# EAGLE design IOBoard (EAGLE 9.6.2)
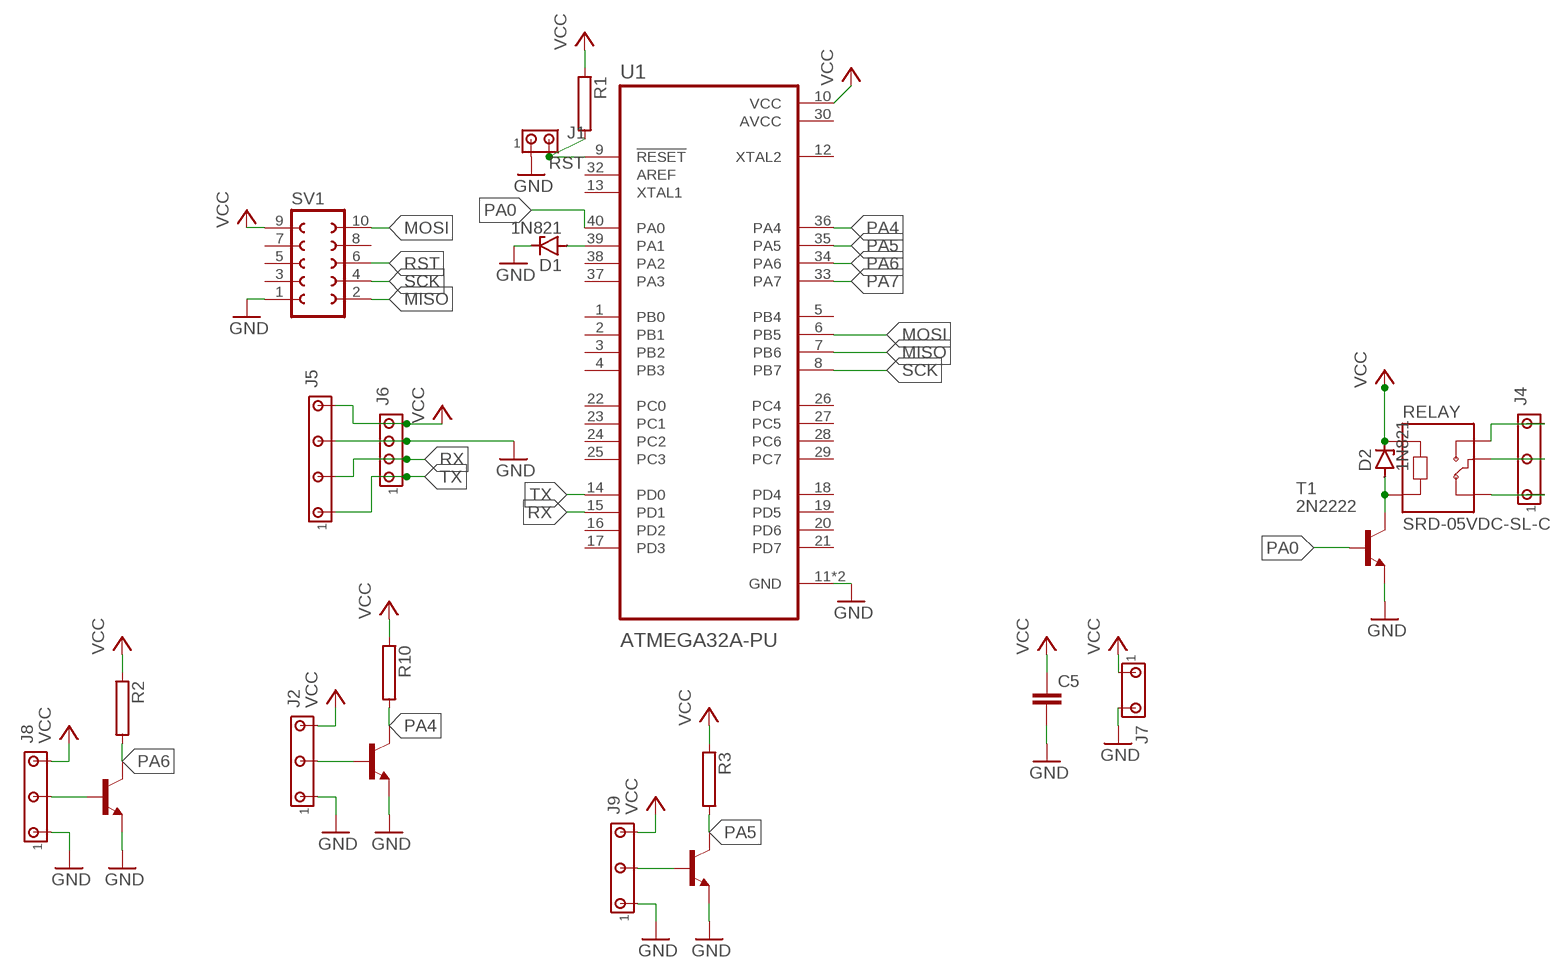
[diagram p0: schematic, sheet 1]

## Parts
C5  C-EU025-024X044  [C025-024X044]
D1  1N821  [DO35Z10]
D2  1N821  [DO35Z10]
J1  MTA02-100  [10X02MTA]
J2  MTA05-156_MYVSPACE1  [10X05MTA_MYV]
J4  MTA05-156_MYVSPACE1  [10X05MTA_MYV]
J5  MTA07-100_MYV  [10X07MTA_MYV]
J6  MTA04-100  [10X04MTA]
J7  MTA03-100_MYV  [10X03MTA_MYV]
J8  MTA05-156_MYVSPACE1  [10X05MTA_MYV]
J9  MTA05-156_MYVSPACE1  [10X05MTA_MYV]
R1  RHPS58  [HPS58]
R2  RHPS58  [HPS58]
R3  RHPS58  [HPS58]
R10  RHPS58  [HPS58]
RELAY  SRD-05VDC-SL-C  [RELAY_SRD-05VDC-SL-C]
SV1  FE05-2_MYV  [FE05-2]
T1  2N2222  [TO18]
T2  2N2222  [TO18]
T5  2N2222  [TO18]
T6  2N2222  [TO18]
U1  ATMEGA32A-PU  [DIP1540W47P254L5320H635Q40B]

## Nets
GND: C5.2 D1.C J1.1 J2.1 J5.5 J6.3 J7.3 J8.1 J9.1 SV1.1 T1.1(E) T2.1(E) T5.1(E) T6.1(E) U1.11(GND) U1.31(GND)
MISO: SV1.2 U1.7(PB6)
MOSI: SV1.10 U1.6(PB5)
N$1: J4.5 RELAY.NO
N$2: J4.3 RELAY.COM
N$3: J4.1 RELAY.NC
N$4: D2.A RELAY.A2 T1.3(C)
N$5: J8.3 T5.2(B)
N$6: J2.3 T2.2(B)
N$7: J9.3 T6.2(B)
PA0: T1.2(B) U1.40(PA0)
PA1: D1.A U1.39(PA1)
PA4: R10.2 T2.3(C) U1.36(PA4)
PA5: R3.2 T6.3(C) U1.35(PA5)
PA6: R2.2 T5.3(C) U1.34(PA6)
PA7: U1.33(PA7)
RST: J1.2 R1.2 SV1.6 U1.9(!RESET)
RX: J5.3 J6.2 U1.15(PD1)
SCK: SV1.4 U1.8(PB7)
TX: J5.1 J6.1 U1.14(PD0)
VCC: C5.1 D2.C J2.5 J5.7 J6.4 J7.1 J8.5 J9.5 R1.1 R2.1 R3.1 R10.1 RELAY.A1 SV1.9 U1.10(VCC)
Unconnected: SV1.3 SV1.5 SV1.7 SV1.8 U1.1(PB0) U1.2(PB1) U1.3(PB2) U1.4(PB3) U1.5(PB4) U1.12(XTAL2) U1.13(XTAL1) U1.16(PD2) U1.17(PD3) U1.18(PD4) U1.19(PD5) U1.20(PD6) U1.21(PD7) U1.22(PC0) U1.23(PC1) U1.24(PC2) U1.25(PC3) U1.26(PC4) U1.27(PC5) U1.28(PC6) U1.29(PC7) U1.32(AREF) U1.37(PA3) U1.38(PA2)

## Power pins joined to a net without a drawn wire
AVCC: U1.30(AVCC)

## Library data of the parts
C5 = rcl:C-EU: CAPACITOR, European symbol; SPICEPREFIX: C
D1 D2 = diode:1N821: Reference DIODE temperature compensated, 6,2 V
J1 = con-amp:MTA02-100: AMP connector
J2 J4 J8 J9 = con-amp_edit:MTA05-156_MYV: AMP connector
J5 = con-amp_edit:MTA07-100_MYV: AMP connector
J6 = con-amp:MTA04-100: AMP connector
J7 = con-amp_edit:MTA03-100_MYV: AMP connector
R1-R3 R10 = resistor-power:R: Power Resitor; OC_FARNELL: unknown; OC_NEWARK: unknown
RELAY = SRD-05VDC-SL-C:SRD-05VDC-SL-C: 5V Trigger Relay Module For Arduino And Raspberry Pi 5V Trigger Relay Module For Arduino And Raspberry Pi; AVAILABILITY: Unavailable; DESCRIPTION: 5V Trigger Relay Module For Arduino And Raspberry Pi 5V Trigger Relay Module For Arduino And Raspberry Pi; MF: Songle Relay; MP: SRD-05VDC-SL-C; PACKAGE: None; PRICE: None
SV1 = con-lsta:FE05-2_MYV: FEMALE HEADER; OC_FARNELL: unknown; OC_NEWARK: unknown
T1 T2 T5 T6 = transistor:2N2222: NPN TRANSISTOR
U1 = ATMEGA32A-PU:ATMEGA32A-PU; AVAILABILITY: Unavailable; DESCRIPTION: IC MCU 8BIT 32KB FLASH 40DIP; MF: Microchip Technology; MP: ATMEGA32A-PU; PACKAGE: None; PRICE: None

## Board
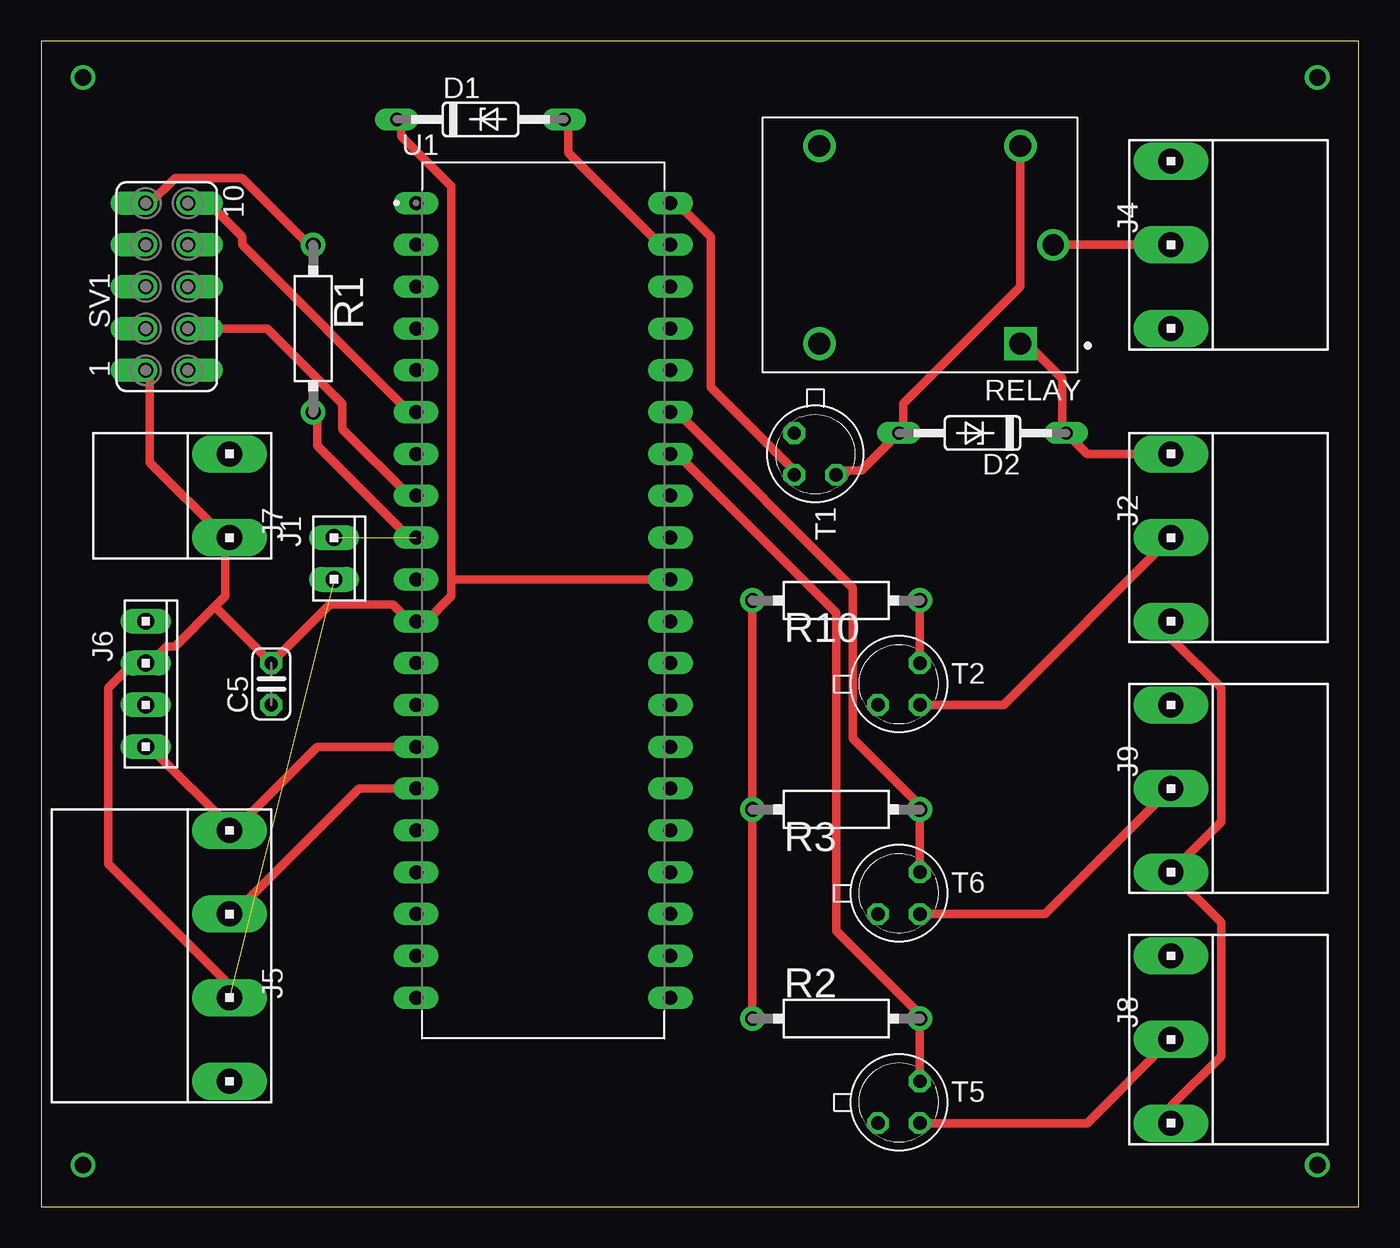
[diagram p1: board, top side]
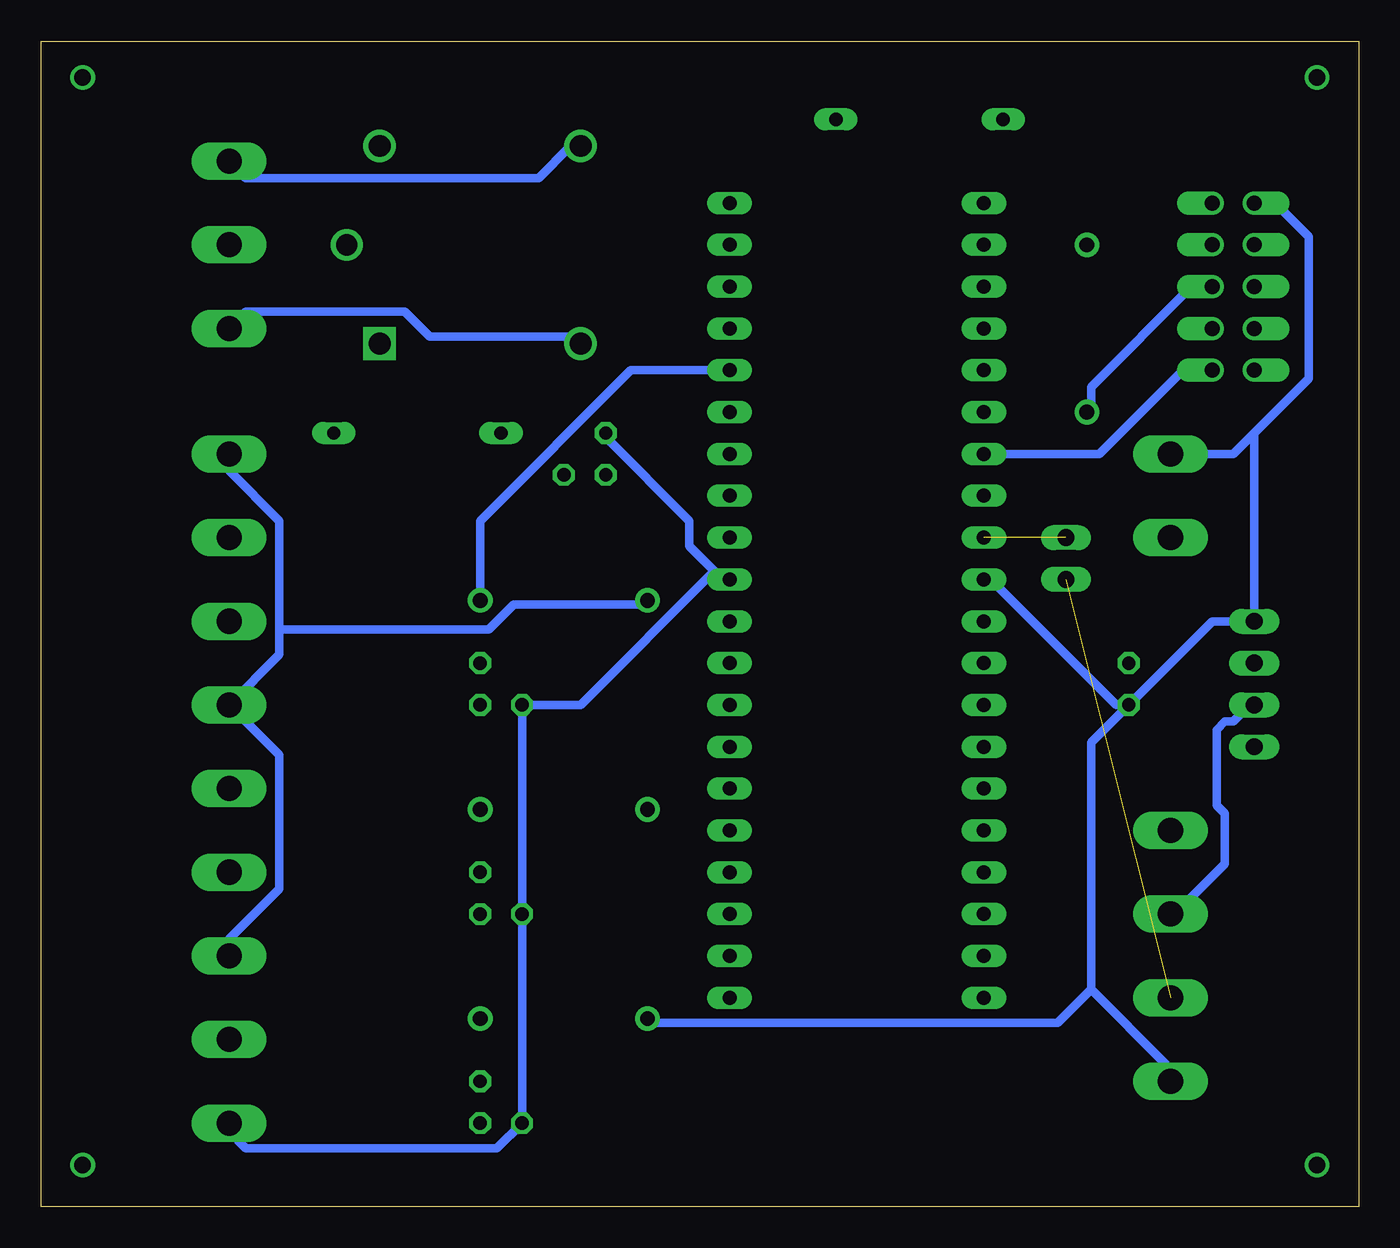
[diagram p2: board, bottom side, seen from below]

Size 79.99 x 70.79 mm. Coordinates in mm from the lower left corner, seen from the top.
Outline: 0,0 79.99,0 79.99,70.79 0,70.79 0,0
Copper layers (1*16): Top 0.035mm / dielectric 1.5mm / Bottom 0.035mm
Design rules "default *": minimum track width 20mil, minimum drill 0.35mm, track to track 20mil, track to pad 20mil, pad to pad 20mil, via to via 20mil, smd to smd 20mil, copper to edge 40mil, drill to drill 6mil, minimum pad ring 10mil, minimum via ring 8mil, stop-mask expansion 4mil, vias tented up to drill 0mil, thermal gap 10mil

### Footprints (pad centres in the part's own frame; a part is rotated, then mirrored left to right if it is on the bottom)
C025-024X044 = drill 0.813 octagon: 1 -1.27,0; 2 1.27,0
DO35Z10 = drill 0.813 long: A 5.08,0; C -5.08,0
10X02MTA = drill 1.016 long: 1 1.27,0; 2 -1.27,0
10X05MTA_MYV = drill 1.524 long: 1 5.08,0; 3 0,0; 5 -5.08,0
10X07MTA_MYV = drill 1.524 long: 1 7.62,0; 3 2.54,0; 5 -2.54,0; 7 -7.62,0
10X04MTA = drill 1.016 long: 1 3.81,0; 2 1.27,0; 3 -1.27,0; 4 -3.81,0
10X03MTA_MYV = drill 1.524 long: 1 2.54,0; 3 -2.54,0
HPS58 = drill 0.9 pad 1.5: 1 -5.08,0; 2 5.08,0
RELAY_SRD-05VDC-SL-C = drill 1.32 square: A1 -6.1,6 | drill 1.32: A2 -6.1,-6; NC 6.1,6; NO 6.1,-6 | drill 1.29: COM -8.1,0
FE05-2 = drill 0.914 offset: 1 -5.08,1.27; 2 -5.08,-1.27; 3 -2.54,1.27; 4 -2.54,-1.27; 5 0,1.27; 6 0,-1.27; 7 2.54,1.27; 8 2.54,-1.27; 9 5.08,1.27; 10 5.08,-1.27
TO18 = drill 0.813 octagon: 1 -1.27,-1.27; 2 1.27,-1.27; 3 1.27,1.27
DIP1540W47P254L5320H635Q40B = drill 0.85 pad 1.28 long: 1 -7.718,24.13; 2 -7.718,21.59; 3 -7.718,19.05; 4 -7.718,16.51; 5 -7.718,13.97; 6 -7.718,11.43; 7 -7.718,8.89; 8 -7.718,6.35; 9 -7.718,3.81; 10 -7.718,1.27; 11 -7.718,-1.27; 12 -7.718,-3.81; 13 -7.718,-6.35; 14 -7.718,-8.89; 15 -7.718,-11.43; 16 -7.718,-13.97; 17 -7.718,-16.51; 18 -7.718,-19.05; 19 -7.718,-21.59; 20 -7.718,-24.13; 21 7.718,-24.13; 22 7.718,-21.59; 23 7.718,-19.05; 24 7.718,-16.51; 25 7.718,-13.97; 26 7.718,-11.43; 27 7.718,-8.89; 28 7.718,-6.35; 29 7.718,-3.81; 30 7.718,-1.27; 31 7.718,1.27; 32 7.718,3.81; 33 7.718,6.35; 34 7.718,8.89; 35 7.718,11.43; 36 7.718,13.97; 37 7.718,16.51; 38 7.718,19.05; 39 7.718,21.59; 40 7.718,24.13

### Placement (x,y rotation side)
C5  13.97,31.75 90 top
D1  26.67,66.04 0 top
D2  57.15,46.99 180 top
J1  17.78,39.37 270 top
J2  68.58,40.64 270 top
J4  68.58,58.42 270 top
J5  11.43,15.24 90 top
J6  6.35,31.75 270 top
J7  11.43,43.18 90 top
J8  68.58,10.16 270 top
J9  68.58,25.4 270 top
R1  16.51,53.34 270 top
R2  48.26,11.43 0 top
R3  48.26,24.13 0 top
R10  48.26,36.83 0 top
RELAY  53.34,58.42 180 top
SV1  7.62,55.88 90 top
T1  46.99,45.72 270 top
T2  52.07,31.75 0 top
T5  52.07,6.35 0 top
T6  52.07,19.05 0 top
U1  30.48,36.83 0 top

### Tracks (layer width: path | path; a pad name or v marks a point on that pad's centre or on a via)
GND  (1 unrouted)
  Top 0.508: 11.18,40.64 6.6,45.21 6.6,50.8 SV1.1 | 10.54,36.45 11.18,37.08 11.18,40.64 | 10.54,36.45 8.13,34.04 7.62,34.04 6.6,33.02 J6.3 5.59,33.02 4.06,31.5 4.06,20.83 11.18,13.72 11.18,12.7 J5.5 | 11.18,40.64 J7.3 | J8.1 68.58,6.1 71.63,9.14 71.63,17.27 J9.1 71.63,23.37 71.63,31.5 68.58,34.54 J2.1 | 24.89,38.1 24.89,37.08 23.37,35.56 U1.11 22.35,35.56 21.34,36.58 17.53,36.58 C5.2 10.54,36.45 | 24.89,38.1 24.89,61.98 21.84,65.02 21.84,66.04 D1.C | 24.89,38.1 U1.31
  Bottom 0.508: 39.12,38.61 38.61,38.1 U1.31 39.12,38.61 | 39.12,38.61 40.64,40.13 40.64,41.66 45.72,46.74 T1.1 | 39.12,38.61 47.24,30.48 T2.1 T6.1 T5.1 52.32,3.56 67.56,3.56 68.58,4.57 J8.1
MISO
  Bottom 0.508: U1.7 15.75,45.72 10.67,50.8 SV1.2
MOSI
  Top 0.508: SV1.10 10.16,60.96 12.19,58.93 12.19,58.42 22.35,48.26 U1.6
N$1
  Bottom 0.508: J4.5 67.56,62.48 49.8,62.48 47.86,64.42 RELAY.NO
N$2
  Top 0.508: J4.3 RELAY.COM
N$3
  Bottom 0.508: J4.1 67.56,54.36 57.91,54.36 56.39,52.83 47.24,52.83 RELAY.NC
N$4
  Top 0.508: T1.3 48.26,44.7 49.78,44.7 D2.A 52.32,47.24 52.32,48.77 59.44,55.88 59.44,64.01 RELAY.A2
N$5
  Top 0.508: T5.2 63.5,5.08 J8.3
N$6
  Top 0.508: T2.2 58.42,30.48 J2.3
N$7
  Top 0.508: T6.2 60.96,17.78 J9.3
N$8  (via drill 1)
  other vias: 2.54,68.58
N$9  (via drill 1)
  other vias: 77.47,68.58
N$10  (via drill 1)
  other vias: 77.47,2.54
N$11  (via drill 1)
  other vias: 2.54,2.54
PA0
  Top 0.508: T1.2 45.72,44.7 40.64,49.78 40.64,58.93 38.61,60.96 U1.40
PA1
  Top 0.508: U1.39 37.59,58.42 32,64.01 32,66.04 D1.A
PA4
  Top 0.508: R10.2 T2.3
  Bottom 0.508: U1.36 44.2,50.8 53.34,41.66 R10.2
PA5
  Top 0.508: T6.3 R3.2 53.34,24.38 49.28,28.45 49.28,37.59 38.61,48.26 U1.35
PA6
  Top 0.508: T5.3 R2.2 53.34,11.68 48.26,16.76 48.26,36.07 38.61,45.72 U1.34
RST  (1 unrouted)
  Top 0.508: U1.9 22.35,40.64 16.76,46.23 16.76,48.26 R1.2
  Bottom 0.508: SV1.6 10.16,55.88 16.26,49.78 16.26,48.26 R1.2
RX
  Top 0.508: U1.15 19.3,25.4 11.68,17.78 J5.3
  Bottom 0.508: J6.2 6.6,30.48 7.62,29.46 8.13,29.46 8.64,28.96 8.64,24.38 8.13,23.88 8.13,20.83 11.18,17.78 J5.3
SCK
  Top 0.508: SV1.4 13.72,53.34 18.29,48.77 18.29,47.24 22.35,43.18 U1.8
TX
  Top 0.508: U1.14 16.76,27.94 11.68,22.86 | 11.68,22.86 6.6,27.94 J6.1 | 11.68,22.86 J5.1
VCC
  Top 0.508: R2.1 R3.1 R10.1 | RELAY.A1 59.94,52.32 61.98,50.29 61.98,47.24 D2.C 63.5,45.72 J2.5 | SV1.9 6.6,60.96 8.13,62.48 12.19,62.48 16.26,58.42 R1.1
  Bottom 0.508: J8.5 68.58,16.26 65.53,19.3 65.53,27.43 J9.5 65.53,33.53 65.53,35.05 | J2.5 68.58,44.7 65.53,41.66 65.53,35.05 | 65.53,35.05 52.83,35.05 51.31,36.58 43.18,36.58 R10.1 | C5.1 14.73,30.48 22.35,38.1 U1.10 | C5.1 8.89,35.56 J6.4 6.35,46.99 | 16.26,13.21 11.68,8.64 11.68,7.62 J5.7 | 16.26,13.21 16.26,28.19 C5.1 | 11.68,45.72 J7.1 7.62,45.72 6.35,46.99 | SV1.9 5.08,60.96 3.05,58.93 3.05,50.29 6.35,46.99 | 16.26,13.21 18.29,11.18 43.18,11.18 R2.1